# EAGLE design mail-mailer (EAGLE 6.1)
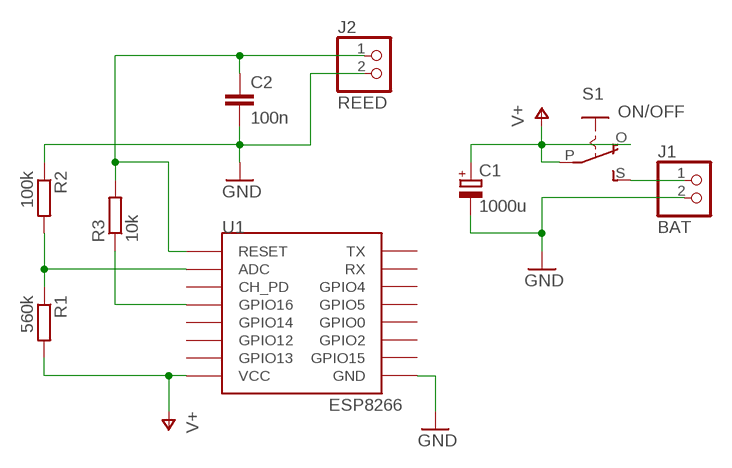
[diagram p0: schematic, sheet 1]

## Parts
C1  1000u  CPOL-EUE3.5-10  [E3,5-10]
C2  100n  C-EU025-025X050  [C025-025X050]
J1  BAT  PINHD-1X2  [1X02]
J2  REED  PINHD-1X2  [1X02]
R1  560k  R-EU_0204/7  [0204/7]
R2  100k  R-EU_0204/7  [0204/7]
R3  10k  R-EU_0204/7  [0204/7]
S1  ON/OFF  EG1218S  [EG1218]
U1  ESP8266  ESP12EDIP  [ESP-12-BREAKOUT]

## Nets
GND: C1.- C2.2 J1.2 J2.2 R2.1 U1.P$9(GND)
J1: J1.1 S1.S
N$2: R1.1 R2.2 U1.P$7(ADC)
N$3: R3.1 U1.P$5(GPIO16)
N$4: C2.1 J2.1 R3.2 U1.P$8(RESET)
V+: C1.+ R1.2 S1.O S1.P U1.P$1(VCC)
Unconnected: U1.P$2(GPIO13) U1.P$3(GPIO12) U1.P$4(GPIO14) U1.P$6(CH_PD) U1.P$10(GPIO15) U1.P$11(GPIO2) U1.P$12(GPIO0) U1.P$13(GPIO5) U1.P$14(GPIO4) U1.P$15(RX) U1.P$16(TX)

## Library data of the parts
C1 = rcl:CPOL-EU: POLARIZED CAPACITOR, European symbol
C2 = rcl:C-EU: CAPACITOR, European symbol
J1 J2 = pinhead:PINHD-1X2: PIN HEADER
R1-R3 = rcl:R-EU_: RESISTOR, European symbol
S1 = _MY_OWN_LIB:EG1218: SLIDING SWITCH 0.1" spacing through hole, vertical SPDT slide switch http://www.ladyada.net/library/pcb/eaglelibrary.html
U1 = _MY_OWN_LIB:ESP12E: ESP12E Module

## Board
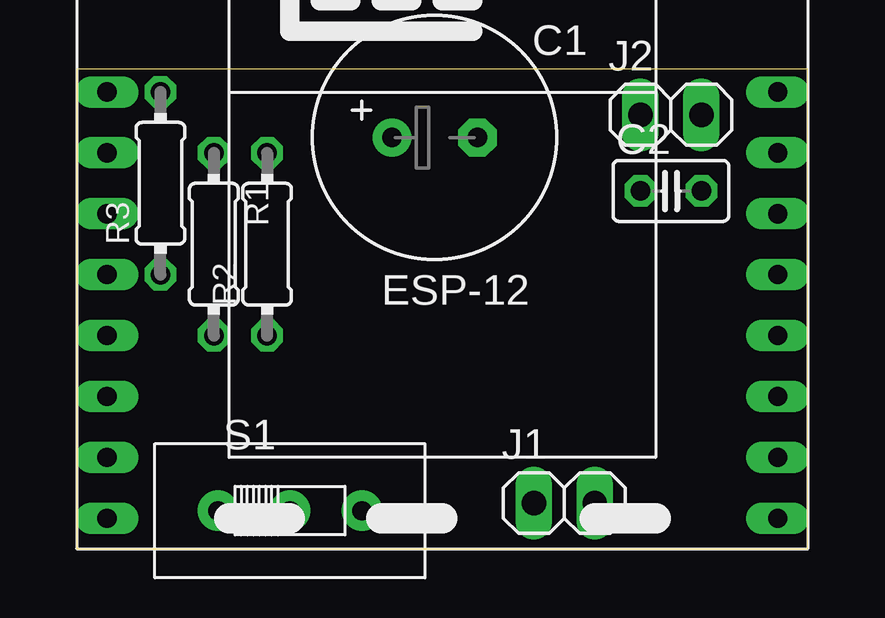
[diagram p1: board, top side]
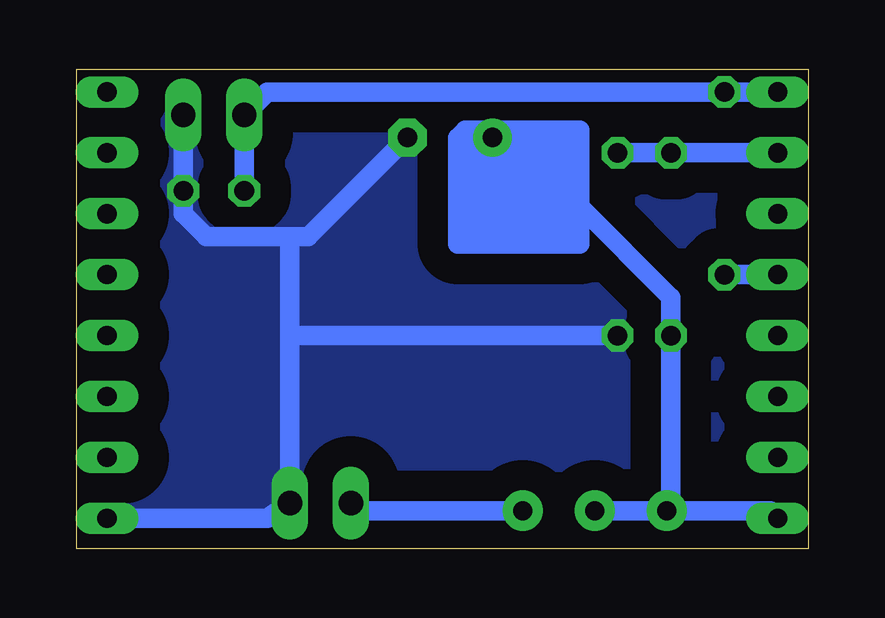
[diagram p2: board, bottom side, seen from below]

Size 30.47 x 19.99 mm. Coordinates in mm from the lower left corner, seen from the top.
Outline: 0,0 30.47,0 30.47,19.99 0,19.99 0,0
Copper layers (1*16): Top 0.035mm / dielectric 1.5mm / Bottom 0.035mm
Design rules: minimum track width 10mil, minimum drill 24mil, track to track 8mil, track to pad 8mil, pad to pad 8mil, via to via 8mil, smd to smd 8mil, copper to edge 40mil, drill to drill 8mil, minimum pad ring 10mil, minimum via ring 8mil, stop-mask expansion 4mil, vias tented up to drill 0mil, thermal gap 10mil

### Footprints (pad centres in the part's own frame; a part is rotated, then mirrored left to right if it is on the bottom)
E3,5-10 = drill 0.813 pad 1.6: + -1.778,0 | drill 0.813 pad 1.6 octagon: - 1.778,0
C025-025X050 = drill 0.813 octagon: 1 -1.27,0; 2 1.27,0
1X02 = drill 1.016 long: 1 -1.27,0; 2 1.27,0
0204/7 = drill 0.813 octagon: 1 -3.81,0; 2 3.81,0
EG1218 = drill 0.8 pad 1.676: O -3,0; P 0,0; S 3,0
ESP-12-BREAKOUT = drill 0.8 long: P$1 0,0; P$2 0,2.54; P$3 0,5.08; P$4 0,7.62; P$5 0,10.16; P$6 0,12.7; P$7 0,15.24; P$8 0,17.78; P$9 27.94,0; P$10 27.94,2.54; P$11 27.94,5.08; P$12 27.94,7.62; P$13 27.94,10.16; P$14 27.94,12.7; P$15 27.94,15.24; P$16 27.94,17.78

### Placement (x,y rotation side)
C1  14.92,17.14 0 top
C2  24.77,14.92 0 top
J1  20.32,1.91 0 top
J2  24.77,18.1 0 top
R1  5.71,12.7 270 top
R2  7.94,12.7 90 top
R3  3.49,15.24 90 top
S1  8.89,1.59 0 top
U1  1.27,1.27 0 top

### Tracks (layer width: path | path; a pad name or v marks a point on that pad's centre or on a via)
GND
  Bottom 0.813: J2.2 C2.2 26.04,13.97 25.08,13.02 21.59,13.02 | 21.59,8.89 J1.2 22.54,1.27 U1.P$9 | 21.59,8.89 21.59,13.02 | R2.1 21.59,8.89 | 21.59,13.02 20.83,13.02 C1.-
  pour Bottom (isolate 1.27, no thermals): -0.95,-0.64 31.11,-0.64 31.11,20.64 -0.95,20.64
J1
  Bottom 0.813: S1.S 18.41,1.59 J1.1
N$1
  Bottom 0.813: 9.84,16.83 10.16,16.83 10.16,13.97 11.11,13.02 14.29,16.19 14.29,13.34 13.97,13.02 12.07,13.02 | 11.75,13.02 12.07,13.02 | 12.07,13.02 13.97,14.92 13.97,13.97 13.65,13.65 13.34,13.65 13.02,13.34
N$2
  Bottom 0.813: U1.P$7 R1.1 R2.2
N$3
  Bottom 0.813: U1.P$5 R3.1
N$4
  Bottom 0.813: U1.P$8 R3.2 22.54,19.05 J2.1 C2.1
V+
  Bottom 0.813: C1.+ 13.02,17.14 | 13.02,17.14 12.38,17.14 9.53,14.29 | 9.53,14.29 5.71,10.48 R1.2 5.71,1.76 S1.O | S1.P S1.O | S1.O 1.59,1.59 U1.P$1 | 13.02,17.14 13.02,17.46 | 12.38,17.46 9.53,17.46 9.53,15.88 | 9.53,14.29 9.53,14.92 | 9.53,14.92 9.53,15.88 | 9.53,15.88 10.8,17.14 11.43,17.14 11.75,16.83 11.43,16.83 10.16,15.56 10.48,15.56 12.38,17.46 | 12.38,17.46 13.02,17.46 | 13.02,17.46 14.29,17.46 14.61,17.14 14.61,12.7 9.53,12.7 9.53,14.29 | 9.53,14.92 10.8,14.92 12.7,16.83 13.02,16.83 | 13.97,16.83 13.02,16.83 | 13.02,16.83 12.7,16.51 | 11.75,15.56 10.16,13.97 10.16,13.34 9.84,13.02 10.16,13.02 13.65,16.51 12.7,16.51 | 12.7,16.51 11.75,15.56 | 11.75,15.56 11.75,14.61 12.07,14.29 12.07,13.97 12.38,13.65